# Altium project Wacky_Racers.PrjPcb
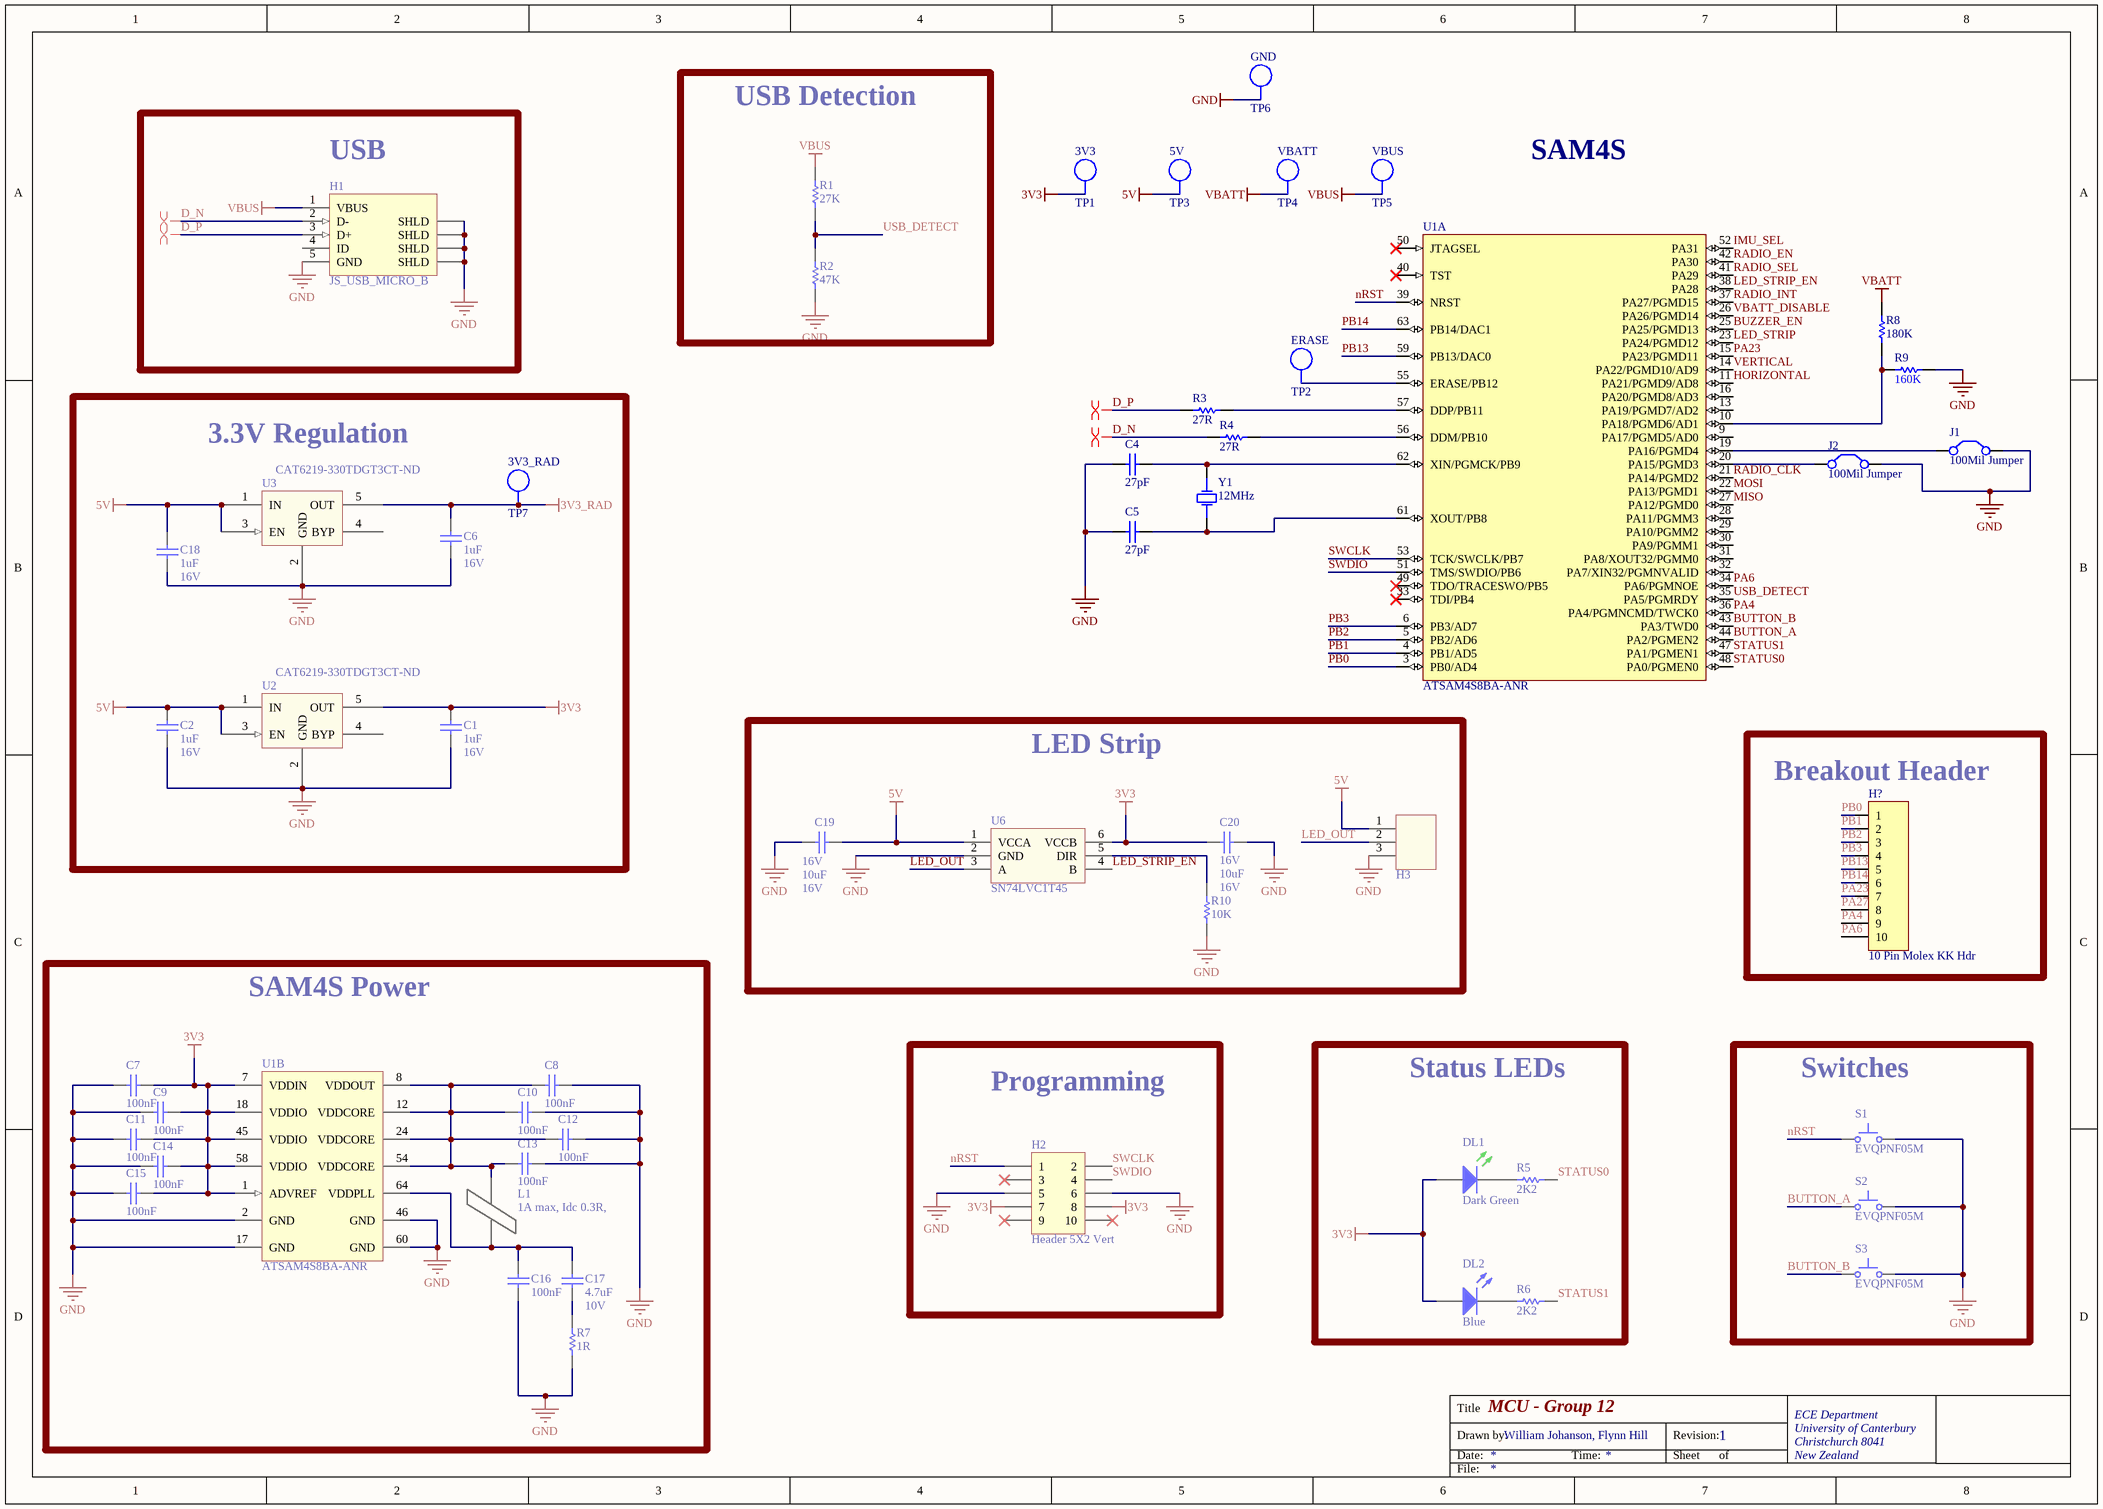
[diagram p0: MCU.SchDoc]
4 sheets, 88 parts. Net scope: global (net labels, ports and power ports of the same name join across sheets).
Board file: hat_PCB.PcbDoc
Sheets:
  MCU.SchDoc
  IMU.SchDoc
  Power.SchDoc
  Radio.SchDoc

## Sheet MCU.SchDoc: MCU - Group 12
size A3; DrawnBy: William Johanson, Flynn Hill; Address1: ECE Department; Address2: University of Canterbury; Address3: Christchurch 8041; Address4: New Zealand; Revision: 1

### Parts
C1  Max Voltage: 16V  [CAPC1608L]  (hidden comment: 1uF)
C2  Max Voltage: 16V  [CAPC1608L]  (hidden comment: 1uF)
C4  27pF  [CAPC1608L]
C5  27pF  [CAPC1608L]
C6  Max Voltage: 16V  [CAPC1608L]  (hidden comment: 1uF)
C7  100nF  [CAPC1608L]
C8  100nF  [CAPC1608L]
C9  100nF  [CAPC1608L]
C10  100nF  [CAPC1608L]
C11  100nF  [CAPC1608L]
C12  100nF  [CAPC1608L]
C13  100nF  [CAPC1608L]
C14  100nF  [CAPC1608L]
C15  100nF  [CAPC1608L]
C16  100nF  [CAPC1608L]
C17  Max Voltage: 10V  [CAPC1608N]  (hidden comment: 4.7uF)
C18  Max Voltage: 16V  [CAPC1608L]  (hidden comment: 1uF)
C19  Voltage - Rated: 16V  [CAPC2012L]  (hidden comment: 10uF)
C20  Voltage - Rated: 16V  [CAPC2012L]  (hidden comment: 10uF)
DL1  Dark Green  [WL-SMCW0603]
DL2  Blue  [WL-SMCW0603]
H1  JS_USB_MICRO_B  [FCI_USB_10118194-0001LF]
H2  Header 5X2 Vert  [IDC2.54-V10D]
H3  HEADER_3  [HEADER_3POS]  (value not drawn)
H?  10 Pin Molex KK Hdr  [MOLEX_KK_10_HDR]
J1  100Mil Jumper  [JMP2.54]
J2  100Mil Jumper  [JMP2.54]
L1  1A max, Idc 0.3R,  [INDC3216L]
R1  27K  [RESC1608L]
R2  47K  [RESC1608N]
R3  27R  [RESC3216L]
R4  27R  [RESC3216L]
R5  2K2  [RESC1608L]
R6  2K2  [RESC1608L]
R7  1R  [RESC3216L]
R8  value 180K  [RESC1608L]
R9  160K  [RESC1608L]
R10  10K  [RESC1608L]
S1  EVQPNF05M  [EVQPNF05M]
S2  EVQPNF05M  [EVQPNF05M]
S3  EVQPNF05M  [EVQPNF05M]
TP1  3V3  [TP_1206]  (no BOM)
TP2  ERASE  [TP_1206]  (no BOM)
TP3  5V  [TP_1206]  (no BOM)
TP4  VBATT  [TP_1206]  (no BOM)
TP5  VBUS  [TP_1206]  (no BOM)
TP6  GND  [TP_1206]  (no BOM)
TP7  3V3_RAD  [TP_1206]  (no BOM)
U1  ATSAM4S8BA-ANR  [LQFP64_L]  (parts A,B of 2)
U2  Supplier Part Number: CAT6219-330TDGT3CT-ND  [SOT95P280X145-5N]  (hidden comment: CAT6219-330TDGT3)
U3  Supplier Part Number: CAT6219-330TDGT3CT-ND  [SOT95P280X145-5N]  (hidden comment: CAT6219-330TDGT3)
U6  SN74LVC1T45  [SOT23-6_N]
Y1  12MHz  [6.0X3.5-4]

### Blocks framed on the sheet
USB: H1
USB Detection: R1 R2
3.3V Regulation: C1 C2 C6 C18 TP7 U2 U3
LED Strip: C19 C20 H3 R10 U6
Breakout Header: H?
SAM4S Power: C7-C17 L1 R7 U1
Programming: H2
Status LEDs: DL1 DL2 R5 R6
Switches: S1-S3

### Nets
3V3: C1.2 C7.2 C9.2 C11.2 C14.2 C15.2 C20.1 DL1.2(A) DL2.2(A) H2.7 H2.8 TP1.1 U1.1(ADVREF) U1.7(VDDIN) U1.18(VDDIO) U1.45(VDDIO) U1.58(VDDIO) U2.5(OUT) U6.6(VCCB)  [project net VDDIO]
3V3_RAD: C6.2 TP7.1 U3.5(OUT)
5V: C2.2 C18.2 C19.2 H3.1 TP3.1 U2.1(IN) U2.3(EN) U3.1(IN) U3.3(EN) U6.1(VCCA)
GND: C1.1 C2.1 C4.1 C5.1 C6.1 C7.1 C8.2 C9.1 C10.2 C11.1 C12.2 C13.2 C14.1 C15.1 C16.1 C18.1 C19.1 C20.2 H1.5(GND) H1.6(SHLD) H2.5 H2.6 H3.3 J1.2(C2) J2.2(C2) R2.1 R7.1 R9.2 R10.1 S1.2 S2.2 S3.2 TP6.1 U1.2(GND) U1.17(GND) U1.46(GND) U1.60(GND) U2.2(GND) U3.2(GND) U6.2(GND)
VBATT: R8.2 TP4.1
VBATT_DISABLE: U1.26(PA26/PGMD14)
VBUS: H1.1(VBUS) R1.2 TP5.1
BUTTON_A: S2.1 U1.44(PA2/PGMEN2)
BUTTON_B: S3.1 U1.43(PA3/TWD0)
BUZZER_EN: U1.25(PA25/PGMD13)
D_N: H1.2(D-) R4.1
D_P: H1.3(D+) R3.1
HORIZONTAL: U1.11(PA21/PGMD9/AD8)
IMU_SEL: U1.52(PA31)
LED_OUT: H3.2 U6.3(A)
LED_STRIP: U1.23(PA24/PGMD12)
LED_STRIP_EN: U1.38(PA28) U6.4(B)
MISO: U1.27(PA12/PGMD0)
MOSI: U1.22(PA13/PGMD1)
nRST: H2.1 S1.1 U1.39(NRST)
PA4: H?.9 U1.36(PA4/PGMNCMD/TWCK0)
PA6: H?.10 U1.34(PA6/PGMNOE)
PA23: H?.7 U1.15(PA23/PGMD11)
PA27: H?.8
PB0: H?.1 U1.3(PB0/AD4)
PB1: H?.2 U1.4(PB1/AD5)
PB2: H?.3 U1.5(PB2/AD6)
PB3: H?.4 U1.6(PB3/AD7)
PB13: H?.5 U1.59(PB13/DAC0)
PB14: H?.6 U1.63(PB14/DAC1)
RADIO_CLK: U1.21(PA14/PGMD2)
RADIO_EN: U1.42(PA30)
RADIO_INT: U1.37(PA27/PGMD15)
RADIO_SEL: U1.41(PA29)
STATUS0: R5.2 U1.48(PA0/PGMEN0)
STATUS1: R6.2 U1.47(PA1/PGMEN1)
SWCLK: H2.2 U1.53(TCK/SWCLK/PB7)
SWDIO: H2.4 U1.51(TMS/SWDIO/PB6)
USB_DETECT: R1.1 R2.2 U1.35(PA5/PGMRDY)
VERTICAL: U1.14(PA22/PGMD10/AD9)
NetC4_2: C4.2 U1.62(XIN/PGMCK/PB9) Y1.3(OSC2)
NetC5_2: C5.2 U1.61(XOUT/PB8) Y1.1(OSC1)
NetC8_1: C8.1 C10.1 C12.1 C13.1 L1.2 U1.8(VDDOUT) U1.12(VDDCORE) U1.24(VDDCORE) U1.54(VDDCORE)
NetC16_2: C16.2 C17.2 L1.1 U1.64(VDDPLL)
NetC17_1: C17.1 R7.2
NetDL1_1: DL1.1(K) R5.1
NetDL2_1: DL2.1(K) R6.1
NetJ1_1: J1.1(C1) U1.19(PA16/PGMD4)
NetJ2_1: J2.1(C1) U1.20(PA15/PGMD3)
NetR3_2: R3.2 U1.57(DDP/PB11)
NetR4_2: R4.2 U1.56(DDM/PB10)
NetR8_1: R8.1 R9.1 U1.10(PA18/PGMD6/AD1)
NetR10_2: R10.2 U6.5(DIR)
NetTP2_1: TP2.1 U1.55(ERASE/PB12)

Not connected (* = marked no-connect by the designer): H1 4(ID); H2 3* 9* 10*; U1 9(PA17/PGMD5/AD0) 13(PA19/PGMD7/AD2) 16(PA20/PGMD8/AD3) 28(PA11/PGMM3) 29(PA10/PGMM2) 30(PA9/PGMM1) 31(PA8/XOUT32/PGMM0) 32(PA7/XIN32/PGMNVALID) 33(TDI/PB4)* 40(TST)* 49(TDO/TRACESWO/PB5)* 50(JTAGSEL)*; U2 4(BYP); U3 4(BYP)

### Layout directives
differential pair: D_N, D_P

### Notes on the sheet
- SAM4S
- Title
- Drawn by:
- Date:
- Time:
- Revision:
- Sheet
- of
- File:

### Library data of the parts
C1 C2 C6 C18 = CC_1uF_0603: CAP CER 1uF Y5V -20% +80% 16V 0603; PackageReference: 0603; Code_IPC: 1608 [0603]; Verify: *; Supplier: ECE Dept; Storage Location: PCB Assembly WS; Value: 1uF
C4 C5 = CC_27pF_0603: CAP CER 27pF NPO/COG +-5% 50V 0603; PackageReference: 0603; Code_IPC: 1608 [0603]; Verify: *; Supplier: ECE Dept; Storage Location: PCB Assembly WS; Value: 27pF
C7-C16 = CC_100nF_0603: CAP CER 100nF X7R +-10% 50V 0603; PackageReference: 0603; Code_IPC: 1608 [0603]; Verify: *; Supplier: ECE Dept; Storage Location: PCB Assembly WS; Value: 100nF
C17 = CC_4.7uF_0603: CAP CER 4.7uF X5R +-20%  10V 0603; Note: Footprint corresponds to dimensions for bulk cassette packaging. This case size has tightened tolerances.; PackageReference: 0805; Code_IPC: 2012[0805]; Verify: *; Supplier: ECE Dept; Storage Location: PCB Assembly WS; Value: 4.7uF
C19 C20 = CC_10uF_16V_0805: CAP CER 10uF X5R 16V 0805; Manufacturer: Samsung Electro-Mechanics; Manufacturer Part Number: CL21A106KOQNNWE; Note: Footprint corresponds to dimensions for bulk cassette packaging. This case size has tightened tolerances.; Tolerance: ±10%; Notification: Current market demand for these product types have resulted in fluctuating and extending lead times. Lead times may differ.; PackageReference: 0805; Code_IPC: 2012[0805]; Supplier 1: Digi-Key; RoHS: RoHS Compliant; Category: Capacitors; Stock 1: 20000; Pricing 1: 1=0.35, 10=0.25, 100=0.1178, 500=0.08254, 1000=0.06831 (NZD); Packaging: Cut Tape (CT); Part Status: Active; Temperature Coefficient: X5R; Operating Temperature: -55°C ~ 85°C; Features: -; Ratings: -; Applications: General Purpose; Mounting Type: Surface Mount, MLCC; Package / Case: 0805 (2012 Metric); Size / Dimension: 0.079" L x 0.049" W (2.00mm x 1.25mm); Height - Seated (Max): -; Thickness (Max): 0.055" (1.40mm); Lead Spacing: -; Lead Style: -; ComponentLink1URL: http://www.samsungsem.com/kr/support/product-search/mlcc/CL21A106KOQNNWE.jsp; ComponentLink1Description: http://www.samsungsem.com/kr/support/product-search/mlcc/CL21A106KOQNNWE.jsp; Supplier Part Number 1: 1276-2894-1-ND; Value: 10uF; Max Voltage: 16V
DL1 = DL_150060GS75000: LED Dk Green 430mcd 0603 SMD; Manufacturer: WURTH ELEKTRONIK; Forward Current If: 30; Wavelength Typ: 520; Forward Voltage: 3.2; Lens Shape: Rectangular; Luminous Intensity: 430; Viewing Angle: 140°; LED Mounting: SMD; Supplier 1: Farnell; Supplier Part Number 1: 2322070; Manufacturer Part Number: 150060GS75000; Storage Location: PCB Assembly WS; Supplier: ECE Dept; LED Colour: Dark Green
DL2 = DL_150060BS75000: LED Blue 270mcd 0603 SMD; Manufacturer: WURTH ELEKTRONIK; Forward Current If: 30; Forward Voltage: 3.2; Luminous Intensity: 270; Viewing Angle: 120°; Wavelength Typ: 470; Pricing: 1=0.3844, 50=0.3252, 100=0.2957, 500=0.2365 (NZD); Supplier 1: Farnell; Supplier Part Number 1: 2322069; Manufacturer Part Number: 150060BS75000; Storage Location: PCB Assembly WS; Supplier: ECE Dept; LED Colour: Blue
H1 = JS_USB_MICRO_B_SMT: CONN USB MICRO B RECPT SMT R/A; Manufacturer: FCI; Manufacturer Part Number: 10118194-0001LF; Gender: Receptacle; Number of Contacts: 5; Specifications: USB 2.0; Supplier 1: Digi-Key; Supplier Part Number 1: 609-4618-1-ND; Features: Shielded, Solder Retention; Mounting Type: Surface Mount, Right Angle, Horizontal
H2 = JA_HDR_IDC_5X2_VERT: IDC Header, 2,54mm, 10-Pin, Vert; Supplier: ECE Dept; Supplier 1: Farnell; Supplier Part Number 1: 1096985; Storage Location: ECE Dept Store
H3 = HEADER_3: 3Pin Header 2.54mm spacing
H? = JA_MOLEX_KK_10POS: CONN HEADER 10POS 2.54mm VERT_ Thru Hole; Supplier 1: Farnell; Supplier Part Number 1: 1756828; Supplier: ECE Dept; Storage Location: ECE Dept Store; Value: 10 Pin Molex KK Hdr
J1 J2 = TP_JUMPER: 2.54mm Jumper Thru Hole; Pitch Spacing: 2.54; No. of Rows: 1; No. of Positions: 2; Supplier: ECE Dept; Supplier 1: Farnell; Supplier Part Number 1: 1097975; Storage Location: ECE$ Store
L1 = IN_Ferrite-Bead: Ferrite Bead, Rdc 0.3R, Z100MHZ 600R, Imax 1A, SMD 1206; Manufacturer: FAIR-RITE; Manufacturer PN: 2512066017Y1; DC Current Rating: 1; DC Resistance Max: 0.08; Ferrite Case Style: 1206 ^3216 Metric]; Frequency Range: 50MHz to 1; Impedance: 600; Impedance Tolerance: ± 25%; Supplier: ECE Dept; Storage Location: PCB Assembly WS; Ferrite Mounting: SMD; Supplier 1: Farnell; Supplier Part Number 1: 1612060; Manufacturer Part Number: 2512066017Y1; Value: 1A max, Idc 0.3R,
R1 = RS_27K: RES 27K OHM 1/10W 5% 0603 SMD; Storage Location: PCB Assembly WS; Supplier: ECE Dept; Value: 27K
R2 = RS_47K: RES 47.0K OHM 1/10W 5% 0603 SMD; Storage Location: PCB Assembly WS; Supplier: ECE Dept; Value: 47K
R3 R4 = RT_27R: RES 27R OHM 1/4W 5% 1206 SMD; Storage Location: PCB Assembly WS; Supplier: ECE Dept; Value: 27R
R5 R6 = RS_2K2: RES 2.2K OHM 1/10W 5% 0603 SMD; Storage Location: PCB Assembly WS; Supplier: ECE Dept; Value: 2K2
R7 = RT_1R: RES 1R OHM 1/4W 5% 1206 SMD; Storage Location: PCB Assembly WS; Supplier: ECE Dept; Value: 1R
R8 = RS_180K: RES 180K OHM 1/10W 5% 0603 SMD; Storage Location: PCB Assembly WS; Supplier: ECE Dept
R9 = RS_160K: RES 160K OHM 1/10W 5% 0603 SMD; Storage Location: PCB Assembly WS; Supplier: ECE Dept; Value: 160K
R10 = RS_10K: RES 10.0K OHM 1/10W 5% 0603 SMD; Storage Location: PCB Assembly WS; Supplier: ECE Dept; Value: 10K
S1-S3 = WS_EVQPNF05M: Panasonic 6 x 3.5mm SMD Light Touch Switch Type SMD; PackageDescription: 6.0 x 3.5 mm; Supplier 1: Farnell; Supplier Part Number 1: 2079481; Manufacturer: Panasonic; Manufacturer PN: EVQPNF05M; Supplier 2: Digi-Key; Supplier Part Number 2: P13598SCT-ND; Storage Location: PCB Assembly WS; Supplier: ECE Dept
TP1-TP7 = TP_1206: Test-Point 3.3x1.6x2.1mm SMD; Manufacturer: Harwin Inc; Manufacturer Part Number: S1751-46R; Value: TP; Manufacturer PN: *; Storage Location: ProtoPlace; Mounting Type: Surface Mount; Type: PC Test Point; Supplier 1: Digi-Key; Supplier Part Number 1: 952-1478-2-ND; Supplier 2: Farnell; Supplier Part Number 2: 1826282; Supplier: ECE Dept
U1 = SE_ATSAM4S16BA-MU: IC MCU 32BIT 512KB FLASH 64LQFP; Manufacturer: Atmel; Connectivity: I²C, IrDA, Memory Card, SPI, SSC, UART/USART, USB; Core Processor: ARM® Cortex®-M4; Core Size: 32-Bit; Data Converters: A/D 11x12b, D/A 2x12b; Number of I/O: 47; Peripherals: Brown-out Detect/Reset, DMA, POR, PWM, WDT; Program Memory Size: 512KB (512K x 8); RAM Size: 128K x 8; Speed: 120MHz; Voltage - Supply (Vcc/Vdd): 1.62 V ~ 3.6 V; PackageVersion: revJ, Jul-2007; PackageReference: 64PS; PackageDescription: 64-Pin Quad Flat No-Lead (QFN) Sawn, 9 x 9 x 1.0 mm Body, 0.5 mm Pitch, Exposed Pad; Code_JEDEC: MO-220VMMD-3; ComponentLink1Description: Manufacturer URL; ComponentLink1URL: http://www.atmel.com/; ComponentLink2Description: SAM4S Series Datasheet; ComponentLink2URL: http://www.atmel.com/dyn/resources/prod_documents/11100.pdf; ComponentLink3Description: SAM4S Series Summary; ComponentLink3URL: http://www.atmel.com/dyn/resources/prod_documents/11100S.pdf; Supplier 1: Digi-Key; Package / Case: 64-LQFP; Packaging: Cut Tape (CT); Program Memory Type: FLASH; Supplier Part Number 1: ATSAM4S8BA-ANRCT-ND; Manufacturer Part Number: ATSAM4S8BA-ANR
U2 U3 = SV_CAT6219-330TDGT3: IC REG LIN 3.3V 500MA TSOT23-5; Voltage - Input (Max): 5.5V; Voltage Dropout (Max): 0.5V @ 500mA; Manufacturer Part Number: CAT6219-330TDGT3; Base Part Number: CAT6219; Current - Output: 500mA; Package / Case: SOT-23-5 Thin, TSOT-23-5; Supplier: Digi-Key; Supplier Device Package: TSOT-23-5; Voltage - Output (Min/Fixed): 3.3V; ComponentLink1URL: http://www.onsemi.com/pub/Collateral/CAT6219-D.PDF; ComponentLink1Description: http://www.onsemi.com/pub/Collateral/CAT6219-D.PDF; Supplier 1: Digi-Key
U6 = SN74LVC1T45: 1.8V - 5V level converter
Y1 = XT_CRYSTAL_12MHz_18pF: CRYSTAL 12MHZ 18PF 6X3.5mm SMD; Manufacturer: CTS-Frequency Controls; Manufacturer Part Number: 406C35D12M00000; ESR (Equivalent Series Resistance): 60 Ohm; Frequency Stability: ±50ppm; Frequency Tolerance: ±30ppm; Operating Mode: Fundamental; Supplier 1: Digi-Key; Height: 0.047" (1.20mm); Load Capacitance: 18pF; Mounting Type: Surface Mount; Operating Temperature: -20°C ~ 70°C; Package / Case: 4-SMD, No Lead (DFN, LCC); Size / Dimension: 0.236" L x 0.138" W (6.00mm x 3.50mm); Supplier Part Number 1: CTX855CT-ND; Frequency: 12MHz

## Sheet IMU.SchDoc: IMU - Group 12
size A3; DrawnBy: William Johanson, Flynn Hill; Address1: ECE Department; Address2: University of Canterbury; Address3: Christchurch 8041; Address4: New Zealand; Revision: 1
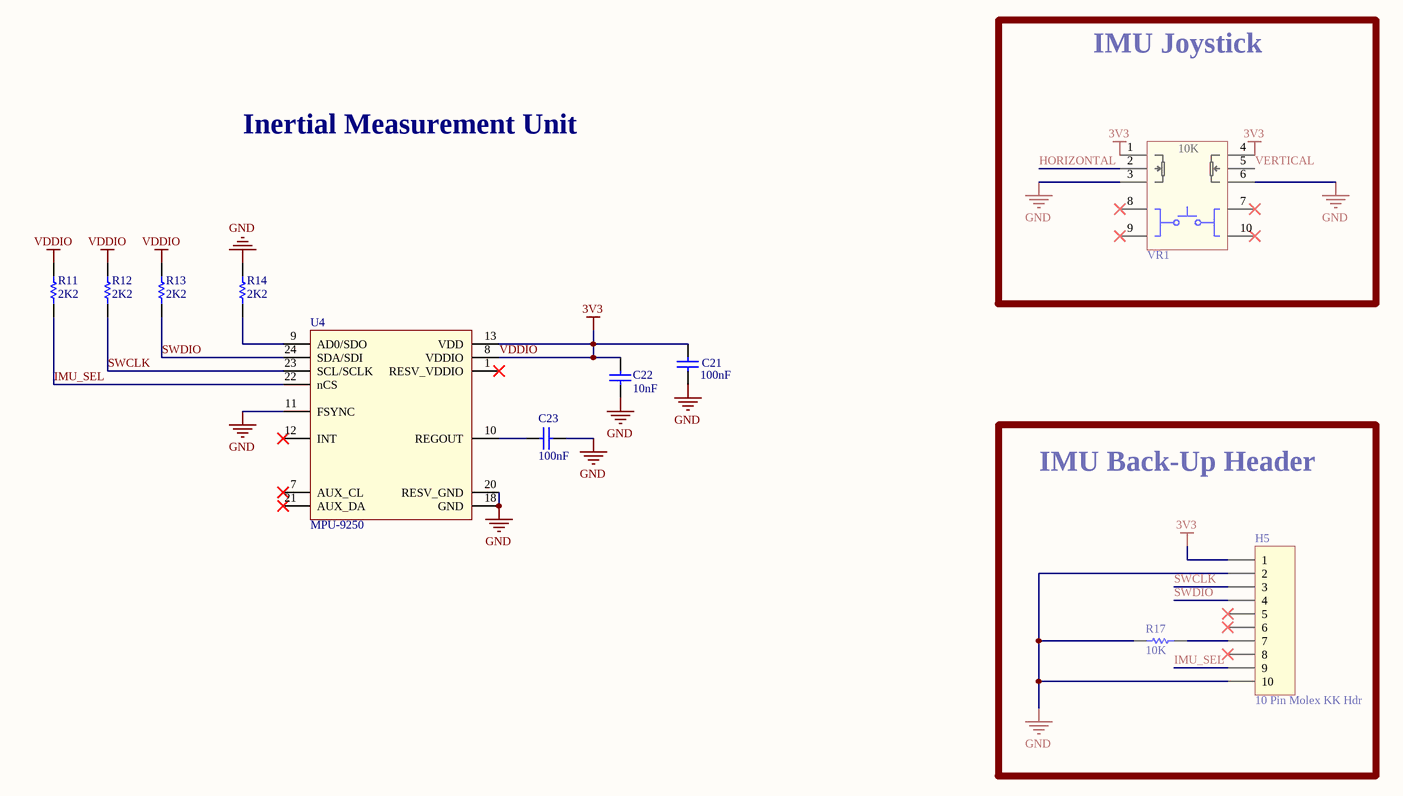
[diagram p1: IMU.SchDoc]

### Parts
C21  100nF  [CAPC1608L]
C22  10nF  [CAPC1608L]
C23  100nF  [CAPC1608L]
H5  10 Pin Molex KK Hdr  [MOLEX_KK_10_HDR]
R11  2K2  [RESC1608L]
R12  2K2  [RESC1608L]
R13  2K2  [RESC1608L]
R14  2K2  [RESC1608L]
R17  10K  [RESC1608L]
U4  MPU-9250  [Quad24]
VR1  Joystick 10k with Sw  [Joystick_Sw]  (value not drawn)

### Blocks framed on the sheet
IMU Joystick: VR1
IMU Back-Up Header: H5 R17

### Nets
GND: C21.1 C22.1 C23.2 H5.2 H5.10 R14.2 R17.1 U4.11(FSYNC) U4.18(GND) U4.20(RESV_GND) VR1.3 VR1.6(3')
VDDIO: C21.2 C22.2 H5.1 R11.2 R12.2 R13.2 U4.8(VDDIO) U4.13(VDD) VR1.1 VR1.4(1')  [also labelled 3V3]
HORIZONTAL: VR1.2
IMU_SEL: H5.9 R11.1 U4.22(nCS)
SWCLK: H5.3 R12.1 U4.23(SCL/SCLK)
SWDIO: H5.4 R13.1 U4.24(SDA/SDI)
VERTICAL: VR1.5(2')
NetC23_1: C23.1 U4.10(REGOUT)
NetH5_7: H5.7 R17.2
NetR14_1: R14.1 U4.9(AD0/SDO)

Not connected (* = marked no-connect by the designer): H5 5* 6* 8*; U4 1(RESV_VDDIO)* 7(AUX_CL)* 12(INT)* 21(AUX_DA)*; VR1 7* 8* 9* 10*

### Notes on the sheet
- Inertial Measurement Unit
- Title
- Drawn by:
- Date:
- Time:
- Revision:
- Sheet
- of
- File:
- (in symbol Joystick 10k with Sw) 10K

### Library data of the parts
C21 C23 = CC_100nF_0603: CAP CER 100nF X7R +-10% 50V 0603; PackageReference: 0603; Code_IPC: 1608 [0603]; Verify: *; Supplier: ECE Dept; Storage Location: PCB Assembly WS; Value: 100nF
C22 = CC_10nF_0603: CAP CER 10nF X7R +-10% 50V 0603; PackageReference: 0603; Code_IPC: 1608 [0603]; Verify: *; Supplier: ECE Dept; Storage Location: PCB Assembly WS; Value: 10nF
H5 = JA_MOLEX_KK_10POS: CONN HEADER 10POS 2.54mm VERT_ Thru Hole; Supplier 1: Farnell; Supplier Part Number 1: 1756828; Supplier: ECE Dept; Storage Location: ECE Dept Store; Value: 10 Pin Molex KK Hdr
R11-R14 = RS_2K2: RES 2.2K OHM 1/10W 5% 0603 SMD; Storage Location: PCB Assembly WS; Supplier: ECE Dept; Value: 2K2
R17 = RS_10K: RES 10.0K OHM 1/10W 5% 0603 SMD; Storage Location: PCB Assembly WS; Supplier: ECE Dept; Value: 10K
U4 = MPU-9250: 9 axis IMU
VR1 = Joystick 10k with Sw: JOYSTICK 10K OHM 2 AXIS TH; Manufacturer 1: SparkFun; Manufacturer Part Number 1: COM-09032; Supplier 1: Digi-Key; Stock 1: 563; Pricing 1: 1=3.95000 (USD); RoHS: No; ComponentLink1URL: https://media.digikey.com/pdf/Data%20Sheets/Sparkfun%20PDFs/COM-09032_Web.pdf?src-supplier=Digi-Key; ComponentLink1Description: https://media.digikey.com/pdf/Data%20Sheets/Sparkfun%20PDFs/COM-09032_Web.pdf?src-supplier=Digi-Key; Supplier Part Number 1: 1568-1526-ND

## Sheet Power.SchDoc: Power - Group 12
size A3; DrawnBy: William Johanson, Flynn Hill; Address1: ECE Department; Address2: University of Canterbury; Address3: Christchurch 8041; Address4: New Zealand; Revision: 1
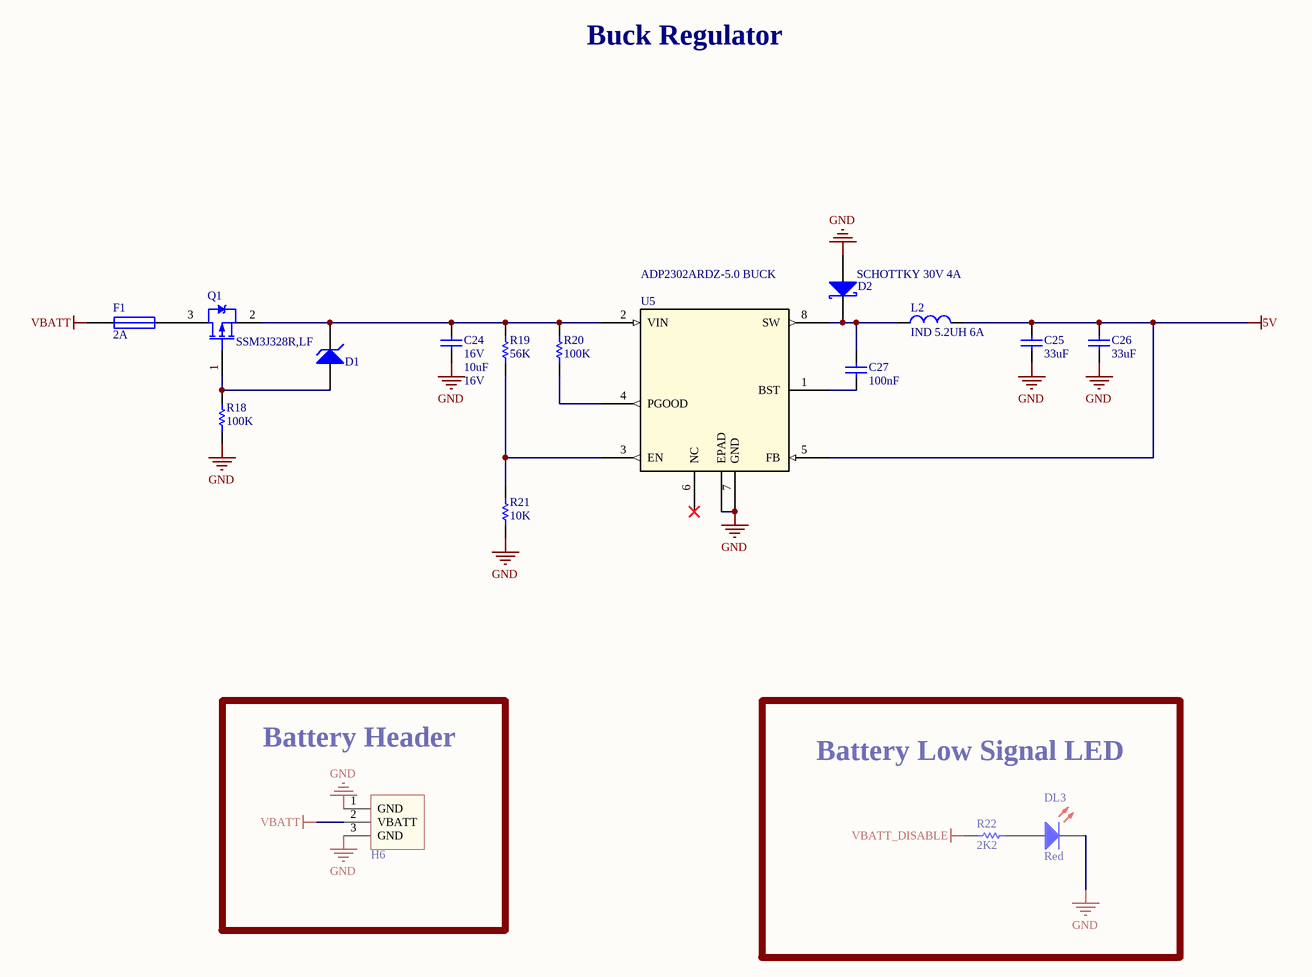
[diagram p2: Power.SchDoc]

### Parts
C24  Voltage - Rated: 16V  [CAPC2012L]  (hidden comment: 10uF)
C25  33uF  [CAPC2012L]
C26  33uF  [CAPC2012L]
C27  100nF  [CAPC1608L]
D1  DIODE ZENER 5.6V  [DO-214AA_SCL]  (value not drawn)
D2  SCHOTTKY 30V 4A  [SMC]
DL3  Red  [WL-SMCW0603]
F1  2A  [RESC3216N]
H6  Battery_HEADER_3pin  [BATT_HEADER_3POS]  (value not drawn)
L2  IND 5.2UH 6A  [INDUCTOR5u2]
Q1  SSM3J328R,LF  [SOT23_L]
R18  100K  [RESC1608L]
R19  56K  [RESC1608L]
R20  100K  [RESC1608L]
R21  10K  [RESC1608L]
R22  2K2  [RESC1608L]
U5  ADP2302ARDZ-5.0 BUCK  [RD_8_1]

### Blocks framed on the sheet
Battery Header: H6
Battery Low Signal LED: DL3 R22

### Nets
5V: C25.2 C26.2 L2.2 U5.5(FB)
GND: C24.1 C25.1 C26.1 D2.1(A) DL3.1(K) H6.1(GND) H6.3(GND) R18.1 R21.1 U5.7(GND) U5.EPAD
VBATT: F1.2 H6.2(VBATT)
VBATT_DISABLE: R22.1
NetC24_2: C24.2 D1.1(K) Q1.2 R19.2 R20.2 U5.2(VIN)
NetC27_1: C27.1 U5.1(BST)
NetC27_2: C27.2 D2.2(K) L2.1 U5.8(SW)
NetD1_2: D1.2(A) Q1.1 R18.2
NetDL3_2: DL3.2(A) R22.2
NetF1_1: F1.1 Q1.3
NetR19_1: R19.1 R21.2 U5.3(EN)
NetR20_1: R20.1 U5.4(PGOOD)

Not connected (* = marked no-connect by the designer): U5 6(NC)*

### Notes on the sheet
- Buck Regulator
- Title
- Drawn by:
- Date:
- Time:
- Revision:
- Sheet
- of
- File:

### Library data of the parts
C24 = CC_10uF_16V_0805: as C19 on sheet MCU; PackageReference: 0805; Code_IPC: 2012[0805]; Supplier 1: Digi-Key; RoHS: RoHS Compliant; Category: Capacitors; Stock 1: 20000; Pricing 1: 1=0.35, 10=0.25, 100=0.1178, 500=0.08254, 1000=0.06831 (NZD); Packaging: Cut Tape (CT); Part Status: Active; Temperature Coefficient: X5R; Operating Temperature: -55°C ~ 85°C; Features: -; Ratings: -; Applications: General Purpose; Mounting Type: Surface Mount, MLCC; Package / Case: 0805 (2012 Metric); Size / Dimension: 0.079" L x 0.049" W (2.00mm x 1.25mm); Height - Seated (Max): -; Thickness (Max): 0.055" (1.40mm); Lead Spacing: -; Lead Style: -; ComponentLink1URL: http://www.samsungsem.com/kr/support/product-search/mlcc/CL21A106KOQNNWE.jsp; ComponentLink1Description: http://www.samsungsem.com/kr/support/product-search/mlcc/CL21A106KOQNNWE.jsp; Supplier Part Number 1: 1276-2894-1-ND; Value: 10uF; Max Voltage: 16V
C25 C26 = CC_33uF_6V3_0805: CAP CER 33uF X5R 6V3 0805; Manufacturer: TDK Corporation; Manufacturer Part Number: C2012X5R0J336M125AC; Tolerance: ±20%; Voltage - Rated: 6.3V; Notification: Current market demand for these product types have resulted in fluctuating and extending lead times. Lead times may differ.; Supplier 1: Digi-Key; RoHS: RoHS Compliant; Category: Capacitors; Stock 1: 20000; Pricing 1: 1=1.65, 10=1.262, 100=0.9023, 500=0.6985, 1000=0.60149 (NZD); Packaging: Cut Tape (CT); Part Status: Active; Temperature Coefficient: X5R; Operating Temperature: -55°C ~ 85°C; Features: Low ESL; Ratings: -; Applications: General Purpose; Failure Rate: -; Mounting Type: Surface Mount, MLCC; Package / Case: 0805 (2012 Metric); Size / Dimension: 0.079" L x 0.049" W (2.00mm x 1.25mm); Height - Seated (Max): -; Thickness (Max): 0.057" (1.45mm); Lead Spacing: -; Lead Style: -; ComponentLink1URL: https://product.tdk.com/info/en/catalog/datasheets/mlcc_commercial_general_en.pdf; ComponentLink1Description: https://product.tdk.com/info/en/catalog/datasheets/mlcc_commercial_general_en.pdf; Supplier Part Number 1: 445-5986-1-ND; Value: 33uF
C27 = CC_100nF_0603: CAP CER 100nF X7R +-10% 50V 0603; PackageReference: 0603; Code_IPC: 1608 [0603]; Verify: *; Supplier: ECE Dept; Storage Location: PCB Assembly WS; Value: 100nF
D1 = SMBJ5339B-TP: DIODE ZENER 5.6V 5W DO214AA; Manufacturer: Micro Commercial Co; Tolerance: ±5%; Supplier 1: Digi-Key; Manufacturer Part Number: SMBJ5339B-TP; RoHS: RoHS Compliant; Category: Discrete Semiconductor Products; Stock 1: 85990; Pricing 1: 1=1.47, 10=1.277, 25=1.1312, 100=0.9853, 250=0.85764, 500=0.72988, 1000=0.58391 (NZD); Packaging: Cut Tape (CT); Part Status: Active; Operating Temperature: -55°C ~ 150°C; Mounting Type: Surface Mount; Package / Case: DO-214AA, SMB; Supplier Device Package: DO-214AA (SMB); Base Part Number: SMBJ5339; ComponentLink1URL: http://www.mccsemi.com/up_pdf/SMBJ5338B-SMBJ5388B(SMB).pdf; ComponentLink1Description: http://www.mccsemi.com/up_pdf/SMBJ5338B-SMBJ5388B(SMB).pdf; Supplier Part Number 1: SMBJ5339B-TPMSCT-ND
D2 = MBRS330T3G: DIODE SCHOTTKY 30V 4A SMC; Manufacturer: ON Semiconductor; Speed: Fast Recovery =< 500ns, > 200mA (Io); Supplier 1: Digi-Key; Manufacturer Part Number: MBRS330T3G; RoHS: RoHS Compliant; Category: Discrete Semiconductor Products; Stock 1: 8919; Pricing 1: 1=0.93, 10=0.79, 100=0.5902, 500=0.46368, 1000=0.35829 (NZD); Packaging: Cut Tape (CT); Part Status: Active; Diode Type: Schottky; Current - Average Rectified (Io): 4A; Capacitance @ Vr, F: -; Mounting Type: Surface Mount; Package / Case: DO-214AB, SMC; Supplier Device Package: SMC; Operating Temperature - Junction: -65°C ~ 150°C; Base Part Number: MBRS330; ComponentLink1URL: http://www.onsemi.com/pub/Collateral/MBRS340T3-D.PDF; ComponentLink1Description: http://www.onsemi.com/pub/Collateral/MBRS340T3-D.PDF; Supplier Part Number 1: MBRS330T3GOSCT-ND
DL3 = DL_150060RS75000: LED Red 250mcd 0603 SMD; Manufacturer: WURTH ELEKTRONIK; Forward Current If: 30; Forward Voltage: 2; Lens Shape: Rectangular; Luminous Intensity: 250; Wavelength Typ: 625; Viewing Angle: 140°; LED Mounting: SMD; Supplier 1: Farnell; Supplier Part Number 1: 2322071; Manufacturer Part Number: 150060RS75000; Storage Location: PCB Assembly WS; Supplier: ECE Dept; LED Colour: Red
F1 = FS_Fuse_2.0A: Fuse 2.0A Very Fast Acting 1206 SMD; Manufacturer: MULTICOMP; Manufacturer PN: MC12CF 002; Supplier: ECE Dept; Storage Location: PCB Assembly WS; Supplier 1: Farnell; Supplier Part Number 1: 1841029; Manufacturer Part Number: MC12CF 002; Value: 2A
H6 = Battery_HEADER_3pin: 3Pin Header 2.54mm spacing
L2 = CDRH104RNP-5R2NC: FIXED IND 5.2UH 6A 22 MOHM SMD; Manufacturer: Sumida America Components Inc.; Material - Core: Ferrite; Tolerance: ±30%; Current - Saturation: 5.6A; Shielding: Shielded; DC Resistance (DCR): 22 mOhm Max; Supplier 1: Digi-Key; Manufacturer Part Number: CDRH104RNP-5R2NC; RoHS: RoHS Compliant; Category: Inductors, Coils, Chokes; Stock 1: 3849; Pricing 1: 1=2.9, 10=2.678, 100=1.8743, 500=1.5173 (NZD); Packaging: Cut Tape (CT); Part Status: Active; Type: -; Q @ Freq: -; Frequency - Self Resonant: -; Ratings: -; Operating Temperature: -40°C ~ 100°C; Mounting Type: Surface Mount; Package / Case: Nonstandard; Supplier Device Package: -; Size / Dimension: 0.402" L x 0.394" W (10.20mm x 10.00mm); Height - Seated (Max): 0.157" (4.00mm); ComponentLink1URL: http://products.sumida.com/products/pdf/CDRH104R.pdf; ComponentLink1Description: http://products.sumida.com/products/pdf/CDRH104R.pdf; Supplier Part Number 1: 308-2280-1-ND
Q1 = TM_SSM3J328R: MOSFET P-CH 20V 6A SOT23-3; Manufacturer: Toshiba; FET Feature: Logic Level Gate, 1.5V Drive; FET Type: MOSFET P-Channel, Metal Oxide; Gate Charge (Qg) @ Vgs: 12.8nC @ 4.5V; Input Capacitance (Ciss) @ Vds: 840pF @ 10V; Power - Max: 1W; Rds On Max: 29.8mR; Drain to Source Resistance: 47.4mR; Turn-On Delay Time: 32ns; Power Dissipation: 2W; Number of Channels: 1; Turn-Off Delay Time: 107ns; Gate to Source Voltage (Vgs): 8V; Input Capacitance: 840pF; Element Configuration: Single; Drain to Source Breakdown Voltage: -20V; Vgs(th) (Max) @ Id: 1V @ 1mA; Current - Continuous Drain (Id) @ 25° C: 6A; Drain to Source Voltage (Vdss): 20V; Package / Case: SOT-23-3 Flat Leads; Supplier Device Package: SOT-23F; Pricing: 1=0.79, 10=0.658, 25=0.5772, 100=0.4939, 250=0.42836, 500=0.36284, 1000=0.27972 (NZD); Storage Location: PCB Assembly WS; Supplier: Digi-Key; ComponentLink1URL: https://datasheet.ciiva.com/11158/ssm3j328r-datasheet-en-20140301-11158652.pdf; ComponentLink1Description: https://datasheet.ciiva.com/11158/ssm3j328r-datasheet-en-20140301-11158652.pdf; Supplier Part Number: SSM3J328RLFDKR-ND; Max Operating Temperature: 150°C; Mount: Surface Mount; Packaging: Tape and Reel; Min Operating Temperature: -55°C; Continuous Drain Current (ID): 6A; Radiation Hardening: No; Max Power Dissipation: 1W; Package Quantity: 3000; Case/Package: SOT-23-3; Number of Pins: 3; Number of Elements: 1; Supplier 1: Digi-Key; Supplier Part Number 1: SSM3J328RLFDKR-ND; Manufacturer Part Number: SSM3J328R,LF
R18 R20 = RS_100K: RES 100K OHM 1/10W 5% 0603 SMD; Storage Location: PCB Assembly WS; Supplier: ECE Dept; Value: 100K
R19 = RS_56K: RES 56.0K OHM 1/10W 5% 0603 SMD; Storage Location: PCB Assembly WS; Supplier: ECE Dept; Value: 56K
R21 = RS_10K: RES 10.0K OHM 1/10W 5% 0603 SMD; Storage Location: PCB Assembly WS; Supplier: ECE Dept; Value: 10K
R22 = RS_2K2: RES 2.2K OHM 1/10W 5% 0603 SMD; Storage Location: PCB Assembly WS; Supplier: ECE Dept; Value: 2K2
U5 = ADP2302ARDZ-5.0-R7: IC REG BUCK 5V 2A 8SOIC; Vendor: Analog Devices Inc; Frequency - Switching: 700kHz; Output Type: Fixed; Voltage - Input (Max): 20V; Manufacturer_Part_Number: ADP2302ARDZ-5.0-R7; Type: DEV; Value: Value; Supplier 1: Digi-Key; Current - Output: 2A; Voltage - Output (Min/Fixed): 5V; Supplier Part Number 1: ADP2302ARDZ-5.0-R7CT-ND

## Sheet Radio.SchDoc: Radio/Buzzer - Group 12
size A3; DrawnBy: William Johanson, Flynn Hill; Address1: ECE Department; Address2: University of Canterbury; Address3: Christchurch 8041; Address4: New Zealand; Revision: 1
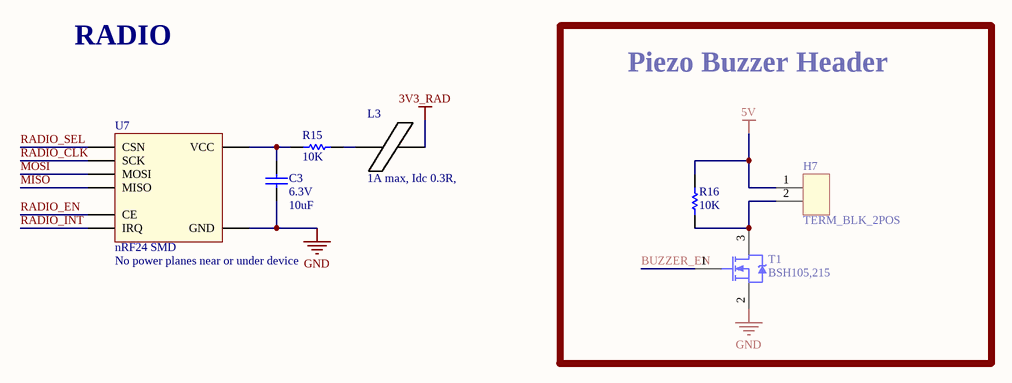
[diagram p3: Radio.SchDoc]

### Parts
C3  Voltage - Rated: 6.3V  [CAPC1608L]  (hidden comment: 10uF)
H7  TERM_BLK_2POS  [TERM_BLK_2POS]
L3  1A max, Idc 0.3R,  [INDC3216L]
R15  10K  [RESC1608L]
R16  10K  [RESC1608L]
T1  BSH105,215  [SOT23_L]
U7  nRF24 SMD  Warning: No power planes near or under device  [NRF24]

### Blocks framed on the sheet
Piezo Buzzer Header: H7 R16 T1

### Nets
3V3_RAD: L3.2
5V: H7.1 R16.2
GND: C3.1 T1.2 U7.2(GND)
BUZZER_EN: T1.1
MISO: U7.7(MISO)
MOSI: U7.6(MOSI)
RADIO_CLK: U7.5(SCK)
RADIO_EN: U7.3(CE)
RADIO_INT: U7.8(IRQ)
RADIO_SEL: U7.4(CSN)
NetC3_2: C3.2 R15.1 U7.1(VCC)
NetH7_2: H7.2 R16.1 T1.3
NetL3_1: L3.1 R15.2

### Notes on the sheet
- RADIO
- Title
- Drawn by:
- Date:
- Time:
- Revision:
- Sheet
- of
- File:

### Library data of the parts
C3 = CC_10uF_0603: CAP CER 10UF X5R +-20% 6V3 0603; Supplier: ECE Dept; Storage Location: PCB Assembly WS; Value: 10uF
H7 = TERM_BLK_2POS: 2 Position Terminal Block 7.62mm spacing
L3 = IN_Ferrite-Bead: as L1 on sheet MCU; Supplier: ECE Dept; Storage Location: PCB Assembly WS; Ferrite Mounting: SMD; Supplier 1: Farnell; Supplier Part Number 1: 1612060; Manufacturer Part Number: 2512066017Y1; Value: 1A max, Idc 0.3R,
R15 R16 = RS_10K: RES 10.0K OHM 1/10W 5% 0603 SMD; Storage Location: PCB Assembly WS; Supplier: ECE Dept; Value: 10K
T1 = TM_BSH105: MOSFET N-CH 20V 1.05A SOT-23; Manufacturer: NXP Semiconductors; FET Type: MOSFET N-Channel, Metal Oxide; Gate Charge (Qg) @ Vgs: 3.9nC @ 4.5V; Input Capacitance (Ciss) @ Vds: 152pF @ 16V; Power - Max: 417mW; Rds On (Max) @ Id, Vgs: 200 mOhm @ 600mA, 4.5V; Supplier 1: Farnell; Supplier 2: Digi-Key; Current - Continuous Drain (Id) @ 25° C: 1.05A; Drain to Source Voltage (Vdss): 20V; Package / Case: TO-236-3, SC-59, SOT-23-3; Pricing: 1=0.53, 10=0.42, 25=0.3544, 100=0.2885, 250=0.23896, 500=0.1974, 1000=0.14785 (NZD); Supplier Part Number 1: 1758066; Supplier Part Number 2: 568-6215-1-ND; Storage Location: PCB Assembly WS; Supplier: ECE Dept; Manufacturer Part Number: BSH105,215
U7 = NRF24: nRF24 SMD Module

## Nets that join several sheets
3V3_RAD: MCU (C6.2 TP7.1 U3.5), Radio (L3.2)
5V: MCU (10 pins), Power (C25.2 C26.2 L2.2 U5.5), Radio (H7.1 R16.2)
GND: MCU (40 pins), IMU (12 pins), Power (11 pins), Radio (C3.1 T1.2 U7.2)
VBATT: MCU (R8.2 TP4.1), Power (F1.2 H6.2)
VBATT_DISABLE: MCU (U1.26), Power (R22.1)
VDDIO: MCU (19 pins), IMU (10 pins)
BUZZER_EN: MCU (U1.25), Radio (T1.1)
HORIZONTAL: MCU (U1.11), IMU (VR1.2)
IMU_SEL: MCU (U1.52), IMU (H5.9 R11.1 U4.22)
MISO: MCU (U1.27), Radio (U7.7)
MOSI: MCU (U1.22), Radio (U7.6)
RADIO_CLK: MCU (U1.21), Radio (U7.5)
RADIO_EN: MCU (U1.42), Radio (U7.3)
RADIO_INT: MCU (U1.37), Radio (U7.8)
RADIO_SEL: MCU (U1.41), Radio (U7.4)
SWCLK: MCU (H2.2 U1.53), IMU (H5.3 R12.1 U4.23)
SWDIO: MCU (H2.4 U1.51), IMU (H5.4 R13.1 U4.24)
VERTICAL: MCU (U1.14), IMU (VR1.5)